# EAGLE design M624A (EAGLE 6.6.0)
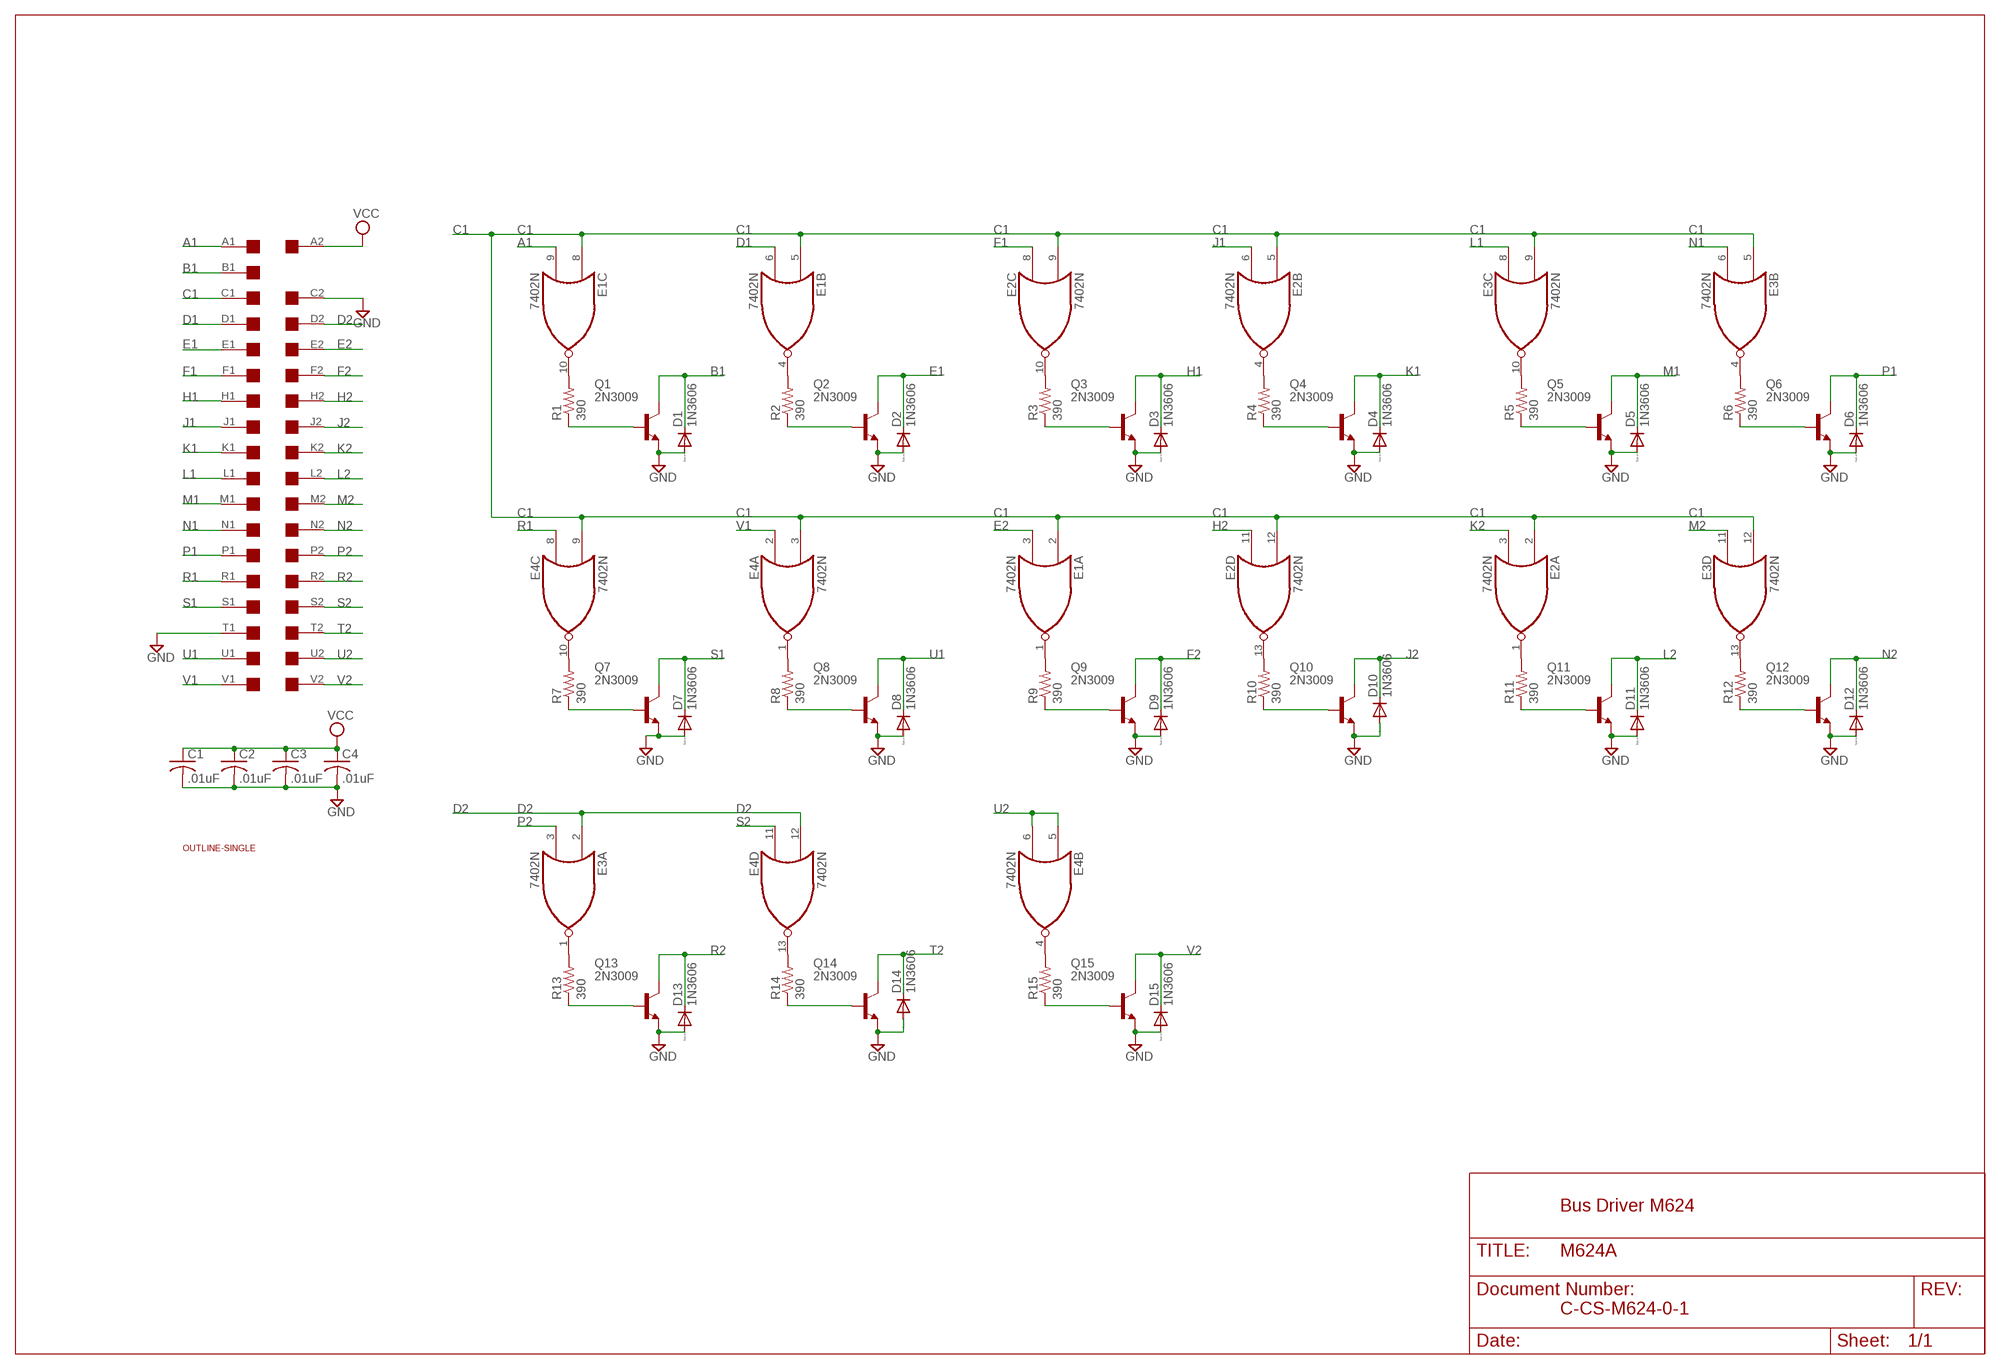
[diagram p0: schematic, sheet 1]

## Parts
C1  .01uF  C-US050-025X075  [C050-025X075]
C2  .01uF  C-US050-025X075  [C050-025X075]
C3  .01uF  C-US050-025X075  [C050-025X075]
C4  .01uF  C-US050-025X075  [C050-025X075]
D1  1N3606  1N4148DO35-10  [DO35-10]
D2  1N3606  1N4148DO35-10  [DO35-10]
D3  1N3606  1N4148DO35-10  [DO35-10]
D4  1N3606  1N4148DO35-10  [DO35-10]
D5  1N3606  1N4148DO35-10  [DO35-10]
D6  1N3606  1N4148DO35-10  [DO35-10]
D7  1N3606  1N4148DO35-10  [DO35-10]
D8  1N3606  1N4148DO35-10  [DO35-10]
D9  1N3606  1N4148DO35-10  [DO35-10]
D10  1N3606  1N4148DO35-10  [DO35-10]
D11  1N3606  1N4148DO35-10  [DO35-10]
D12  1N3606  1N4148DO35-10  [DO35-10]
D13  1N3606  1N4148DO35-10  [DO35-10]
D14  1N3606  1N4148DO35-10  [DO35-10]
D15  1N3606  1N4148DO35-10  [DO35-10]
E1  7402N  [DIL14]
E2  7402N  [DIL14]
E3  7402N  [DIL14]
E4  7402N  [DIL14]
Q1  2N3009  2N1613-NPN-TO39-EBC  [TO39]
Q2  2N3009  2N1613-NPN-TO39-EBC  [TO39]
Q3  2N3009  2N1613-NPN-TO39-EBC  [TO39]
Q4  2N3009  2N1613-NPN-TO39-EBC  [TO39]
Q5  2N3009  2N1613-NPN-TO39-EBC  [TO39]
Q6  2N3009  2N1613-NPN-TO39-EBC  [TO39]
Q7  2N3009  2N1613-NPN-TO39-EBC  [TO39]
Q8  2N3009  2N1613-NPN-TO39-EBC  [TO39]
Q9  2N3009  2N1613-NPN-TO39-EBC  [TO39]
Q10  2N3009  2N1613-NPN-TO39-EBC  [TO39]
Q11  2N3009  2N1613-NPN-TO39-EBC  [TO39]
Q12  2N3009  2N1613-NPN-TO39-EBC  [TO39]
Q13  2N3009  2N1613-NPN-TO39-EBC  [TO39]
Q14  2N3009  2N1613-NPN-TO39-EBC  [TO39]
Q15  2N3009  2N1613-NPN-TO39-EBC  [TO39]
R1  390  R-US_0207/10  [0207/10]
R2  390  R-US_0207/10  [0207/10]
R3  390  R-US_0207/10  [0207/10]
R4  390  R-US_0207/10  [0207/10]
R5  390  R-US_0207/10  [0207/10]
R6  390  R-US_0207/10  [0207/10]
R7  390  R-US_0207/10  [0207/10]
R8  390  R-US_0207/10  [0207/10]
R9  390  R-US_0207/10  [0207/10]
R10  390  R-US_0207/10  [0207/10]
R11  390  R-US_0207/10  [0207/10]
R12  390  R-US_0207/10  [0207/10]
R13  390  R-US_0207/10  [0207/10]
R14  390  R-US_0207/10  [0207/10]
R15  390  R-US_0207/10  [0207/10]
U$1  OUTLINE-SINGLE  [SINGLE]
U$4  SINGLE  [EDGE-CON2]

## Nets
A1: E1.9(C:I1) U$4.A1
B1: D1.C Q1.3(C) U$4.B1
C1: E1.2(A:I0) E1.5(B:I0) E1.8(C:I0) E2.2(A:I0) E2.5(B:I0) E2.9(C:I1) E2.12(D:I1) E3.5(B:I0) E3.9(C:I1) E3.12(D:I1) E4.3(A:I1) E4.9(C:I1) U$4.C1
D1: E1.6(B:I1) U$4.D1
D2: E3.2(A:I0) E4.12(D:I1) U$4.D2
E1: D2.C Q2.3(C) U$4.E1
E2: E1.3(A:I1) U$4.E2
F1: E2.8(C:I0) U$4.F1
F2: D9.C Q9.3(C) U$4.F2
GND [Supply]: C1.2 C2.2 C3.2 C4.2 D1.A D2.A D3.A D4.A D5.A D6.A D7.A D8.A D9.A D10.A D11.A D12.A D13.A D14.A D15.A Q1.1(E) Q2.1(E) Q3.1(E) Q4.1(E) Q5.1(E) Q6.1(E) Q7.1(E) Q8.1(E) Q9.1(E) Q10.1(E) Q11.1(E) Q12.1(E) Q13.1(E) Q14.1(E) Q15.1(E) U$4.C2 U$4.T1
H1: D3.C Q3.3(C) U$4.H1
H2: E2.11(D:I0) U$4.H2
J1: E2.6(B:I1) U$4.J1
J2: D10.C Q10.3(C) U$4.J2
K1: D4.C Q4.3(C) U$4.K1
K2: E2.3(A:I1) U$4.K2
L1: E3.8(C:I0) U$4.L1
L2: D11.C Q11.3(C) U$4.L2
M1: D5.C Q5.3(C) U$4.M1
M2: E3.11(D:I0) U$4.M2
N1: E3.6(B:I1) U$4.N1
N2: D12.C Q12.3(C) U$4.N2
N$1: E1.10(C:O) R1.2
N$2: Q1.2(B) R1.1
N$3: E4.10(C:O) R7.2
N$4: Q7.2(B) R7.1
N$5: E3.1(A:O) R13.2
N$6: E4.13(D:O) R14.2
N$7: E4.4(B:O) R15.2
N$9: Q13.2(B) R13.1
N$10: Q14.2(B) R14.1
N$11: Q15.2(B) R15.1
N$12: E1.4(B:O) R2.2
N$13: E4.1(A:O) R8.2
N$14: E1.1(A:O) R9.2
N$15: E2.10(C:O) R3.2
N$16: E2.13(D:O) R10.2
N$17: E2.4(B:O) R4.2
N$18: E2.1(A:O) R11.2
N$19: E3.10(C:O) R5.2
N$20: E3.13(D:O) R12.2
N$21: E3.4(B:O) R6.2
N$22: Q6.2(B) R6.1
N$24: Q2.2(B) R2.1
N$25: Q3.2(B) R3.1
N$26: Q4.2(B) R4.1
N$27: Q5.2(B) R5.1
N$28: Q8.2(B) R8.1
N$29: Q9.2(B) R9.1
N$30: Q10.2(B) R10.1
N$31: Q11.2(B) R11.1
N$32: Q12.2(B) R12.1
P1: D6.C Q6.3(C) U$4.P1
P2: E3.3(A:I1) U$4.P2
R1: E4.8(C:I0) U$4.R1
R2: D13.C Q13.3(C) U$4.R2
S1: D7.C Q7.3(C) U$4.S1
S2: E4.11(D:I0) U$4.S2
T2: D14.C Q14.3(C) U$4.T2
U1: D8.C Q8.3(C) U$4.U1
U2: E4.5(B:I0) E4.6(B:I1) U$4.U2
V1: E4.2(A:I0) U$4.V1
V2: D15.C Q15.3(C) U$4.V2
VCC [Supply]: C1.1 C2.1 C3.1 C4.1 U$4.A2
Unconnected: E1.11(D:I0) E1.12(D:I1) E1.13(D:O) U$4.B2

## Notes on the sheet
- Bus Driver M624
- C-CS-M624-0-1

## Power pins joined to a net without a drawn wire
GND: E1.7(P:GND) E2.7(P:GND) E3.7(P:GND) E4.7(P:GND)
VCC: E1.14(P:VCC) E2.14(P:VCC) E3.14(P:VCC) E4.14(P:VCC)

## Library data of the parts
C1-C4 = rcl:C-US: CAPACITOR, American symbol
D1-D15 = diode:1N4148: DIODE high speed (Philips)
E1-E4 = 74xx-us:74*02: Quad 2-input NOR gate
Q1-Q15 = transistor:*-NPN-: NPN Transistror BF959 corrected 2008.03.06
R1-R15 = rcl:R-US_: RESISTOR, American symbol
U$1 = dec-con:OUTLINE-*: Board outlines for DEC boards.
U$4 = dec-con:SINGLE: Single-Height DEC board

## Net classes
1 Supply: width 0.813 mm

## Board
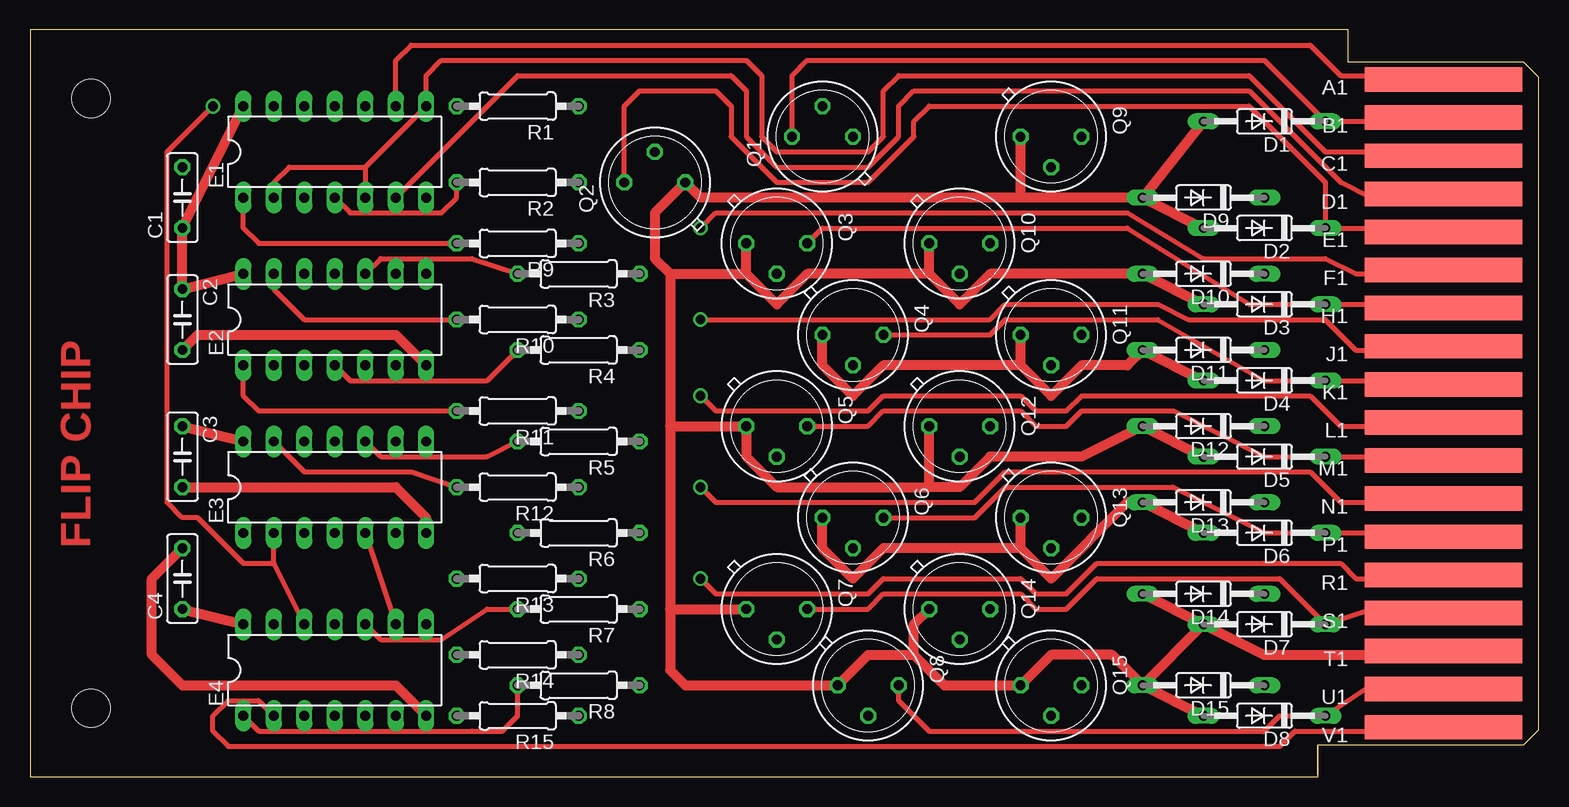
[diagram p1: board, top side]
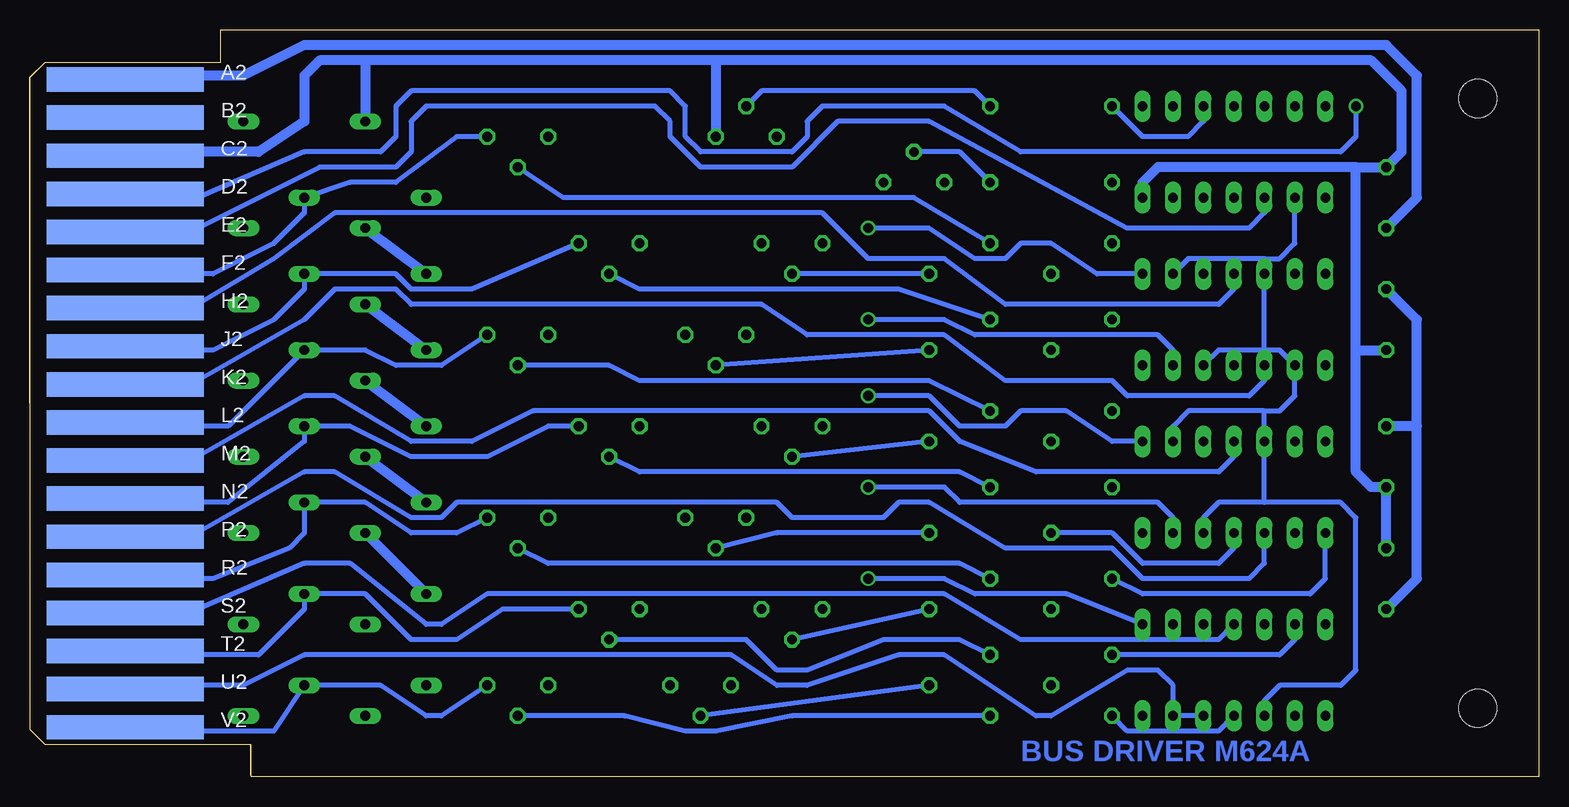
[diagram p2: board, bottom side, seen from below]

Size 125.73 x 62.23 mm. Coordinates in mm from the lower left corner, seen from the top.
Copper layers (1+16): Top 0.035mm / dielectric 1.5mm / Bottom 0.035mm
Design rules "16mils": minimum track width 16mil, minimum drill 32mil, track to track 15mil, track to pad 10mil, pad to pad 10mil, via to via 10mil, smd to smd 10mil, copper to edge 13mil, drill to drill 10mil, minimum pad ring 10mil, minimum via ring 8mil, stop-mask expansion 0mil, vias tented up to drill 0mil, thermal gap 10mil

### Footprints (pad centres in the part's own frame; a part is rotated, then mirrored left to right if it is on the bottom)
C050-025X075 = drill 0.813 octagon: 1 -2.54,0; 2 2.54,0
DO35-10 = drill 0.813 long: A 5.08,0; C -5.08,0
DIL14 = drill 0.813 long: 1 -7.62,-3.81; 2 -5.08,-3.81; 3 -2.54,-3.81; 4 0,-3.81; 5 2.54,-3.81; 6 5.08,-3.81; 7 7.62,-3.81; 8 7.62,3.81; 9 5.08,3.81; 10 2.54,3.81; 11 0,3.81; 12 -2.54,3.81; 13 -5.08,3.81; 14 -7.62,3.81
TO39 = drill 0.813 octagon: 1 0,-2.54; 2 2.54,0; 3 0,2.54
0207/10 = drill 0.813 octagon: 1 -5.08,0; 2 5.08,0
SINGLE = hole 3.175: 120.65,56.515; 120.65,5.715
EDGE-CON2 = smd 13.106 x 2.032: A1 7.938,4.128; B1 7.938,7.303; C1 7.938,10.477; D1 7.938,13.652; E1 7.938,16.828; F1 7.938,20.003; H1 7.938,23.177; J1 7.938,26.352; K1 7.938,29.527; L1 7.938,32.703; M1 7.938,35.877; N1 7.938,39.053; P1 7.938,42.227; R1 7.938,45.403; S1 7.938,48.578; T1 7.938,51.752; U1 7.938,54.928; V1 7.938,58.102 | smd 13.106 x 2.032 bottom: A2 7.938,4.128; B2 7.938,7.303; C2 7.938,10.477; D2 7.938,13.652; E2 7.938,16.828; F2 7.938,20.003; H2 7.938,23.177; J2 7.938,26.352; K2 7.938,29.527; L2 7.938,32.703; M2 7.938,35.877; N2 7.938,39.053; P2 7.938,42.227; R2 7.938,45.403; S2 7.938,48.578; T2 7.938,51.752; U2 7.938,54.928; V2 7.938,58.102

### Placement (x,y rotation side)
C1  12.7,48.26 90 top
C2  12.7,38.1 270 top
C3  12.7,26.67 270 top
C4  12.7,16.51 90 top
D1  102.87,54.61 180 top
D2  102.87,45.72 180 top
D3  102.87,39.37 180 top
D4  102.87,33.02 180 top
D5  102.87,26.67 180 top
D6  102.87,20.32 180 top
D7  102.87,12.7 180 top
D8  102.87,5.08 180 top
D9  97.79,48.26 180 top
D10  97.79,41.91 180 top
D11  97.79,35.56 180 top
D12  97.79,29.21 180 top
D13  97.79,22.86 180 top
D14  97.79,15.24 180 top
D15  97.79,7.62 180 top
E1  25.4,52.07 0 top
E2  25.4,38.1 0 top
E3  25.4,24.13 0 top
E4  25.4,8.89 0 top
Q1  66.04,53.34 90 top
Q2  52.07,49.53 90 top
Q3  62.23,44.45 270 top
Q4  68.58,36.83 270 top
Q5  62.23,29.21 270 top
Q6  68.58,21.59 270 top
Q7  62.23,13.97 270 top
Q8  69.85,7.62 270 top
Q9  85.09,53.34 270 top
Q10  77.47,44.45 270 top
Q11  85.09,36.83 270 top
Q12  77.47,29.21 270 top
Q13  85.09,21.59 270 top
Q14  77.47,13.97 270 top
Q15  85.09,7.62 270 top
R1  40.64,55.88 180 top
R2  40.64,49.53 180 top
R3  45.72,41.91 180 top
R4  45.72,35.56 180 top
R5  45.72,27.94 180 top
R6  45.72,20.32 180 top
R7  45.72,13.97 180 top
R8  45.72,7.62 180 top
R9  40.64,44.45 180 top
R10  40.64,38.1 180 top
R11  40.64,30.48 180 top
R12  40.64,24.13 180 top
R13  40.64,16.51 180 top
R14  40.64,10.16 180 top
R15  40.64,5.08 180 top
U$1  125.73,62.23 180 top
U$2  [FLIPCHIP]  0,0 0 top
U$4  125.73,62.23 180 top

### Tracks (layer width: path | path; a pad name or v marks a point on that pad's centre or on a via)
A1
  Top 0.406: U$4.A1 117.24,58.02 116.84,58.42 109.22,58.42 106.68,60.96 31.75,60.96 30.48,59.69 E1.9
B1
  Top 0.406: Q1.3 63.5,58.42 64.77,59.69 102.87,59.69 D1.C 116.84,54.61 117.13,54.9 U$4.B1
C1
  Top 0.406: U$4.C1 117.17,51.74 116.84,52.07 107.95,52.07 101.6,58.42 72.39,58.42 71.12,57.15 71.12,53.34 69.85,52.07 62.23,52.07 60.96,53.34 60.96,58.42 59.69,59.69 34.29,59.69 33.02,58.42 E1.8 27.94,50.8 | 27.94,50.8 E1.5 | 27.94,50.8 21.59,50.8 20.32,49.53 E1.2 | E3.5 E4.9
  Bottom 0.406: 22.86,43.18 E2.12 22.86,35.56 | 22.86,43.18 29.21,43.18 E2.9 | 22.86,43.18 21.59,43.18 20.32,44.45 E1.2 | E2.5 26.67,35.56 22.86,35.56 | 22.86,35.56 21.59,35.56 E2.2 20.32,31.75 21.59,30.48 22.86,30.48 | E3.9 30.48,29.21 29.21,30.48 22.86,30.48 | 22.86,30.48 E3.12 22.86,22.86 | E3.5 27.94,21.59 26.67,22.86 22.86,22.86 | E4.3 22.86,6.35 21.59,7.62 16.51,7.62 15.24,8.89 15.24,21.59 16.51,22.86 22.86,22.86
D1
  Top 0.406: E1.6 40.64,58.42 58.42,58.42 59.69,57.15 59.69,53.34 62.23,50.8 69.85,50.8 72.39,53.34 72.39,55.88 73.66,57.15 101.6,57.15 109.22,49.53 111.76,48.26 116.84,48.26 U$4.D1
D2  (via drill 0.81)
  Top 0.406: v15.24,55.88 11.43,52.07 11.43,22.86 12.7,21.59 13.97,21.59 17.78,17.78 20.32,17.78 | 20.32,17.78 E4.12 | 20.32,17.78 E3.2
  Bottom 0.406: U$4.D2 116.84,48.26 111.76,48.26 102.87,52.07 96.52,52.07 95.25,53.34 95.25,55.88 93.98,57.15 72.39,57.15 71.12,55.88 71.12,53.34 69.85,52.07 62.23,52.07 60.96,53.34 60.96,54.61 59.69,55.88 49.53,55.88 43.18,52.07 16.51,52.07 15.24,53.34 v15.24,55.88
E1
  Top 0.406: U$4.E1 116.84,45.72 D2.C 107.95,49.53 101.6,55.88 74.93,55.88 73.66,54.61 73.66,53.34 69.85,49.53 62.23,49.53 58.42,53.34 58.42,55.88 57.15,57.15 50.8,57.15 49.53,55.88 Q2.3
E2
  Bottom 0.406: E1.3 22.86,46.99 24.13,45.72 34.29,45.72 50.8,54.61 58.42,54.61 62.23,50.8 69.85,50.8 72.39,53.34 72.39,54.61 73.66,55.88 92.71,55.88 93.98,54.61 93.98,52.07 95.25,50.8 101.6,50.8 111.76,45.72 116.84,45.72 U$4.E2
F1  (via drill 0.81)
  Top 0.406: v55.88,45.72 57.15,46.99 91.44,46.99 97.79,43.18 107.95,43.18 110.49,41.91 116.84,41.91 U$4.F1
  Bottom 0.406: E2.8 36.83,41.91 40.64,44.45 43.18,44.45 44.45,43.18 46.99,43.18 50.8,45.72 v55.88,45.72
F2
  Bottom 0.406: U$4.F2 116.84,41.91 110.49,41.91 105.41,44.45 102.87,46.99 D9.C 99.06,49.53 95.25,49.53 90.17,53.34 Q9.3
GND
  Top 0.813: 53.34,41.91 52.07,43.18 52.07,46.99 Q2.1 55.88,48.26 82.55,48.26 | 53.34,41.91 59.69,41.91 | 59.69,41.91 Q3.1 | 53.34,41.91 53.34,29.21 | 53.34,29.21 53.34,13.97 | 53.34,13.97 Q7.1 | 53.34,29.21 Q5.1 59.69,26.67 62.23,24.13 74.93,24.13 | 53.34,13.97 53.34,8.89 54.61,7.62 Q8.1 69.85,10.16 73.66,10.16 | D15.A D8.A | D7.A D15.A | D14.A D7.A | D6.A D13.A 91.44,22.86 85.09,16.51 82.55,19.05 | D5.A D12.A 87.63,26.67 80.01,26.67 77.47,24.13 74.93,24.13 | D4.A D11.A 91.44,34.29 87.63,34.29 85.09,31.75 82.55,34.29 | D3.A D10.A 80.01,41.91 77.47,39.37 74.93,41.91 | D1.A D9.A | D9.A D2.A | D9.A 82.55,48.26 | 82.55,48.26 Q9.1 | U$4.T1 116.84,10.16 102.87,10.16 D7.A | E4.7 30.48,7.62 12.7,7.62 10.16,10.16 10.16,16.51 C4.2 | E3.7 33.02,21.59 30.48,24.13 C3.2 | E2.7 30.48,36.83 13.97,36.83 C2.2 | D15.A 90.17,10.16 85.09,10.16 Q15.1 76.2,7.62 73.66,10.16 | 73.66,10.16 73.66,12.7 Q14.1 | Q6.1 66.04,19.05 68.58,16.51 71.12,19.05 82.55,19.05 | 82.55,19.05 Q13.1 | 74.93,24.13 Q12.1 | Q4.1 66.04,34.29 68.58,31.75 71.12,34.29 82.55,34.29 | 82.55,34.29 Q11.1 | 74.93,41.91 Q10.1 | 59.69,41.91 62.23,39.37 64.77,41.91 74.93,41.91
  Bottom 0.813: D2.A D10.A | D3.A D11.A | D4.A D12.A | D5.A D13.A | D6.A D14.A | U$4.C2 116.84,52.07 106.68,52.07 102.87,54.61 102.87,58.42 101.6,59.69 97.79,59.69 | 97.79,59.69 D1.A | 68.58,59.69 13.97,59.69 11.43,57.15 11.43,52.07 C1.2 15.24,50.8 | 68.58,59.69 97.79,59.69 | 68.58,59.69 Q1.1 | 15.24,50.8 31.75,50.8 33.02,49.53 E1.7 | C4.2 C3.2 13.97,24.13 15.24,25.4 15.24,35.56 | 15.24,35.56 15.24,50.8 | 15.24,35.56 C2.2
H1
  Top 0.406: U$4.H1 116.84,39.37 D3.C 101.6,39.37 91.44,45.72 66.04,45.72 Q3.3
H2
  Bottom 0.406: U$4.H2 116.84,39.37 111.76,39.37 105.41,43.18 100.33,46.99 59.69,46.99 55.88,43.18 49.53,43.18 44.45,39.37 26.67,39.37 25.4,40.64 E2.11
J1  (via drill 0.81)
  Top 0.406: U$4.J1 116.84,35.56 110.49,35.56 107.95,38.1 96.52,38.1 93.98,39.37 81.28,39.37 80.01,38.1 v55.88,38.1
  Bottom 0.406: E2.6 30.48,35.56 31.75,36.83 46.99,36.83 49.53,38.1 v55.88,38.1
J2
  Bottom 0.406: U$4.J2 116.84,35.56 110.49,35.56 105.41,38.1 102.87,40.64 D10.C 95.25,41.91 93.98,40.64 88.9,40.64 Q10.3
K1
  Top 0.406: U$4.K1 116.84,33.02 D4.C 102.87,33.02 93.98,38.1 81.28,38.1 80.01,36.83 Q4.3
K2
  Bottom 0.406: U$4.K2 116.84,33.02 111.76,33.02 102.87,38.1 100.33,40.64 95.25,40.64 93.98,39.37 64.77,39.37 60.96,36.83 49.53,36.83 44.45,33.02 35.56,33.02 34.29,31.75 24.13,31.75 22.86,33.02 E2.3
L1  (via drill 0.81)
  Top 0.406: U$4.L1 116.84,29.21 109.22,29.21 106.68,31.75 87.63,31.75 86.36,30.48 83.82,30.48 82.55,31.75 71.12,31.75 69.85,30.48 57.15,30.48 v55.88,31.75
  Bottom 0.406: E3.8 35.56,27.94 39.37,30.48 43.18,30.48 44.45,29.21 48.26,29.21 50.8,31.75 v55.88,31.75
L2
  Bottom 0.406: U$4.L2 116.84,29.21 109.22,29.21 D11.C 97.79,35.56 95.25,34.29 91.44,34.29 Q11.3
M1
  Top 0.406: U$4.M1 116.84,26.67 D5.C 102.87,26.67 95.25,30.48 87.63,30.48 86.36,29.21 83.82,29.21 82.55,30.48 71.12,30.48 69.85,29.21 Q5.3
M2
  Bottom 0.406: E3.11 25.4,26.67 26.67,25.4 41.91,25.4 48.26,27.94 50.8,30.48 83.82,30.48 88.9,27.94 93.98,27.94 100.33,31.75 102.87,31.75 111.76,26.67 116.84,26.67 U$4.M2
N1  (via drill 0.81)
  Top 0.406: U$4.N1 116.84,22.86 109.22,22.86 106.68,25.4 81.28,25.4 78.74,22.86 57.15,22.86 v55.88,24.13
  Bottom 0.406: E3.6 30.48,21.59 31.75,22.86 48.26,22.86 49.53,24.13 v55.88,24.13
N2
  Bottom 0.406: U$4.N2 116.84,22.86 109.22,22.86 102.87,27.94 D12.C 99.06,29.21 93.98,26.67 87.63,26.67 82.55,29.21 Q12.3
N$1
  Bottom 0.406: E1.10 27.94,54.61 29.21,53.34 33.02,53.34 R1.2
N$2
  Bottom 0.406: R1.1 46.99,57.15 64.77,57.15 Q1.2
N$3
  Top 0.406: E4.10 29.21,11.43 34.29,11.43 38.1,13.97 R7.2
N$4
  Bottom 0.406: R7.1 Q7.2
N$5
  Bottom 0.406: E3.1 17.78,16.51 19.05,15.24 33.02,15.24 R13.2
N$6
  Bottom 0.406: R14.2 21.59,10.16 20.32,11.43 E4.13
N$7
  Bottom 0.406: E4.4 26.67,3.81 34.29,3.81 R15.2
N$9
  Bottom 0.406: R13.1 48.26,17.78 82.55,17.78 Q13.2
N$10
  Bottom 0.406: R14.1 48.26,11.43 54.61,11.43 60.96,8.89 63.5,8.89 66.04,11.43 Q14.2
N$11
  Bottom 0.406: R15.1 62.23,5.08 68.58,3.81 71.12,3.81 76.2,5.08 Q15.2
N$12
  Top 0.406: R2.2 35.56,48.26 34.29,46.99 26.67,46.99 E1.4
N$13
  Top 0.406: E4.1 19.05,3.81 36.83,3.81 38.1,3.81 39.37,3.81 40.64,5.08 40.64,6.35 R8.2
N$14
  Top 0.406: R9.2 19.05,44.45 17.78,45.72 E1.1
N$15
  Top 0.406: E2.10 29.21,43.18 36.83,43.18 R3.2
N$16
  Top 0.406: E2.13 20.32,40.64 22.86,38.1 R10.2
N$17
  Top 0.406: E2.4 26.67,33.02 38.1,33.02 R4.2
N$18
  Top 0.406: R11.2 19.05,30.48 17.78,31.75 E2.1
N$19
  Top 0.406: E3.10 29.21,26.67 38.1,26.67 R5.2
N$20
  Top 0.406: E3.13 22.86,25.4 31.75,25.4 R12.2
N$21
  Bottom 0.406: E3.4 25.4,19.05 26.67,17.78 33.02,17.78 35.56,20.32 R6.2
N$22
  Bottom 0.406: R6.1 63.5,20.32 Q6.2
N$24
  Bottom 0.406: R2.1 48.26,52.07 Q2.2
N$25
  Bottom 0.406: R3.1 Q3.2
N$26
  Bottom 0.406: R4.1 Q4.2
N$27
  Bottom 0.406: R5.1 Q5.2
N$28
  Bottom 0.406: R8.1 Q8.2
N$29
  Bottom 0.406: R9.1 52.07,48.26 81.28,48.26 Q9.2
N$30
  Bottom 0.406: R10.1 53.34,40.64 74.93,40.64 Q10.2
N$31
  Bottom 0.406: R11.1 50.8,33.02 74.93,33.02 77.47,34.29 Q11.2
N$32
  Bottom 0.406: R12.1 48.26,25.4 74.93,25.4 Q12.2
P1
  Top 0.406: U$4.P1 116.84,20.32 D6.C 102.87,20.32 95.25,24.13 81.28,24.13 78.74,21.59 Q6.3
P2
  Bottom 0.406: E3.3 22.86,17.78 24.13,16.51 33.02,16.51 35.56,19.05 44.45,19.05 50.8,22.86 53.34,22.86 54.61,21.59 62.23,21.59 63.5,22.86 90.17,22.86 91.44,21.59 93.98,21.59 100.33,25.4 102.87,25.4 111.76,20.32 116.84,20.32 U$4.P2
R1  (via drill 0.81)
  Top 0.406: v55.88,16.51 57.15,15.24 69.85,15.24 71.12,16.51 82.55,16.51 83.82,15.24 86.36,15.24 88.9,17.78 109.22,17.78 110.49,16.51 116.84,16.51 U$4.R1
  Bottom 0.406: E4.8 39.37,15.24 46.99,15.24 49.53,16.51 v55.88,16.51
R2
  Bottom 0.406: U$4.R2 116.84,16.51 110.49,16.51 104.14,19.05 102.87,20.32 D13.C 97.79,22.86 93.98,20.32 90.17,20.32 Q13.3
S1
  Top 0.406: U$4.S1 116.84,13.97 111.76,13.97 D7.C 104.14,16.51 88.9,16.51 86.36,13.97 83.82,13.97 82.55,15.24 71.12,15.24 69.85,13.97 Q7.3
S2
  Bottom 0.406: E4.11 26.67,11.43 43.18,11.43 49.53,15.24 87.63,15.24 91.44,12.7 92.71,12.7 99.06,17.78 102.87,17.78 111.76,13.97 116.84,13.97 U$4.S2
T2
  Bottom 0.406: U$4.T2 116.84,10.16 106.68,10.16 102.87,13.97 D14.C 97.79,15.24 93.98,11.43 90.17,11.43 86.36,13.97 Q14.3
U1
  Top 0.406: U$4.U1 116.84,7.62 111.76,7.62 D8.C 104.14,5.08 102.87,3.81 74.93,3.81 72.39,6.35 Q8.3
U2
  Bottom 0.406: E4.5 E4.6 30.48,7.62 31.75,8.89 34.29,8.89 40.64,5.08 41.91,5.08 49.53,10.16 53.34,10.16 60.96,7.62 63.5,7.62 67.31,10.16 102.87,10.16 107.95,7.62 116.84,7.62 U$4.U2
V1
  Top 0.406: U$4.V1 116.84,3.81 105.41,3.81 104.14,2.54 16.51,2.54 15.24,3.81 15.24,5.08 16.51,6.35 19.05,6.35 E4.2
V2
  Bottom 0.406: U$4.V2 116.84,3.81 105.41,3.81 D15.C 96.52,7.62 92.71,5.08 91.44,5.08 Q15.3
VCC
  Top 0.813: C4.1 E4.14 | C3.1 E3.14 | E2.14 C2.1 C1.1 E1.14
  Bottom 0.813: U$4.A2 116.84,58.42 107.95,58.42 102.87,60.96 12.7,60.96 10.16,58.42 10.16,48.26 C1.1 | C4.1 10.16,16.51 10.16,29.21 | 10.16,29.21 10.16,38.1 C2.1 | 10.16,29.21 C3.1

### Text on the board
Bottom: BUS DRIVER M624A